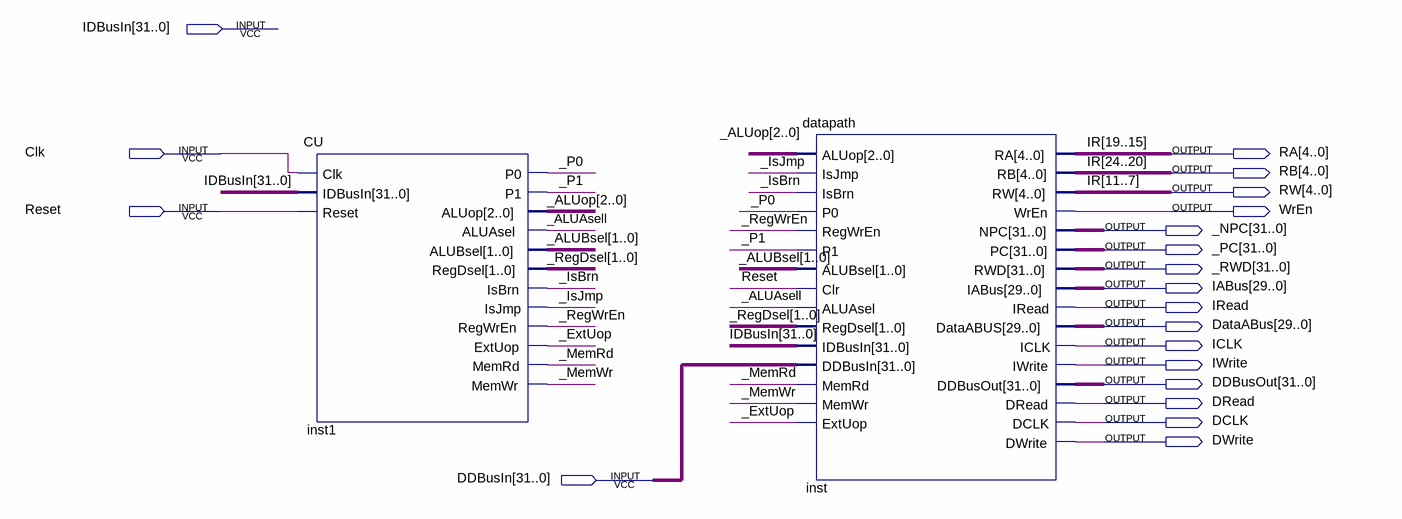
[diagram p0: schematic sheet]
// Quartus schematic CPU.bdf as structural Verilog: 2 symbols, 20 pins
module CPU (
  input  [31:0] IDBusIn,
  input  Clk,
  input  Reset,
  input  [31:0] DDBusIn,
  output [4:0] RA,
  output [4:0] RB,
  output [4:0] RW,
  output WrEn,
  output [31:0] _NPC,
  output [31:0] _PC,
  output [31:0] _RWD,
  output [29:0] IABus,
  output IRead,
  output [29:0] DataABus,
  output ICLK,
  output IWrite,
  output [31:0] DDBusOut,
  output DRead,
  output DCLK,
  output DWrite
);

  wire _ALUAsell, _ExtUop, _IsBrn, _IsJmp, _MemRd, _MemWr, _P0, _P1, _RegWrEn;
  wire [1:0] _ALUBsel, _RegDsel;
  wire [2:0] _ALUop;

  CU inst1 (
    .Clk(Clk), .IDBusIn(IDBusIn), .Reset(Reset), .P0(_P0), .P1(_P1), .ALUop(_ALUop), .ALUAsel(_ALUAsell),
    .ALUBsel(_ALUBsel), .RegDsel(_RegDsel), .IsBrn(_IsBrn), .IsJmp(_IsJmp), .RegWrEn(_RegWrEn),
    .ExtUop(_ExtUop), .MemRd(_MemRd), .MemWr(_MemWr));
  datapath inst (
    .ALUop(_ALUop), .IsJmp(_IsJmp), .IsBrn(_IsBrn), .P0(_P0), .RegWrEn(_RegWrEn), .P1(_P1),
    .ALUBsel(_ALUBsel), .Clr(Reset), .ALUAsel(_ALUAsell), .RegDsel(_RegDsel), .IDBusIn(IDBusIn),
    .DDBusIn(DDBusIn), .MemRd(_MemRd), .MemWr(_MemWr), .ExtUop(_ExtUop), .RA(RA), .RB(RB), .RW(RW),
    .WrEn(WrEn), .NPC(_NPC), .PC(_PC), .RWD(_RWD), .IABus(IABus), .IRead(IRead), .DataABUS(DataABus),
    .ICLK(ICLK), .IWrite(IWrite), .DDBusOut(DDBusOut), .DRead(DRead), .DCLK(DCLK), .DWrite(DWrite));

  // Other names for the same wires on the sheet: IR (some bits) = {RB, RA, RW}
endmodule
